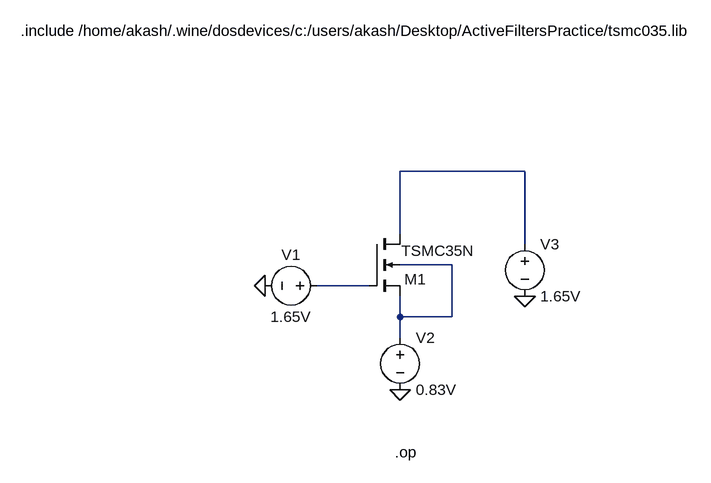
[diagram p0: schematic Draft5.asc]
Draft5.asc, the LTspice schematic file:
Version 4
SHEET 1 880 688
WIRE 464 240 272 240
WIRE 272 336 272 240
WIRE 464 352 464 240
WIRE 352 384 272 384
WIRE 224 416 144 416
WIRE 272 464 272 432
WIRE 352 464 352 384
WIRE 352 464 272 464
WIRE 272 496 272 464
FLAG 64 416 0
FLAG 272 576 0
FLAG 464 432 0
SYMBOL nmos4 224 336 R0
WINDOW 0 55 70 Left 2
WINDOW 3 50 26 Left 2
SYMATTR InstName M1
SYMATTR Value TSMC35N
SYMATTR Value2 l=0.5u w=26.5u
SYMBOL voltage 160 416 R90
WINDOW 0 -32 56 VBottom 2
WINDOW 3 32 56 VTop 2
WINDOW 123 0 0 Left 0
WINDOW 39 0 0 Left 0
SYMATTR InstName V1
SYMATTR Value 1.65V
SYMBOL voltage 272 480 R0
WINDOW 123 0 0 Left 0
WINDOW 39 0 0 Left 0
SYMATTR InstName V2
SYMATTR Value 0.83V
SYMBOL voltage 464 336 R0
WINDOW 123 0 0 Left 0
WINDOW 39 0 0 Left 0
SYMATTR InstName V3
SYMATTR Value 1.65V
TEXT -312 24 Left 2 !.include /home/akash/.wine/dosdevices/c:/users/akash/Desktop/ActiveFiltersPractice/tsmc035.lib
TEXT 264 672 Left 2 !.op

The netlist it stands for:
* Draft5.asc
M1 N001 N003 N002 N002 TSMC35N l=0.5u w=26.5u
V1 N003 0 1.65V
V2 N002 0 0.83V
V3 N001 0 1.65V
.model NMOS NMOS
.model PMOS PMOS
.lib standard.mos
.include /home/akash/.wine/dosdevices/c:/users/akash/Desktop/ActiveFiltersPractice/tsmc035.lib
.op
.backanno
.end